# Altium schematic sheet Sheet3.SchDoc
size A3; SheetNumber: 1; SheetTotal: 1
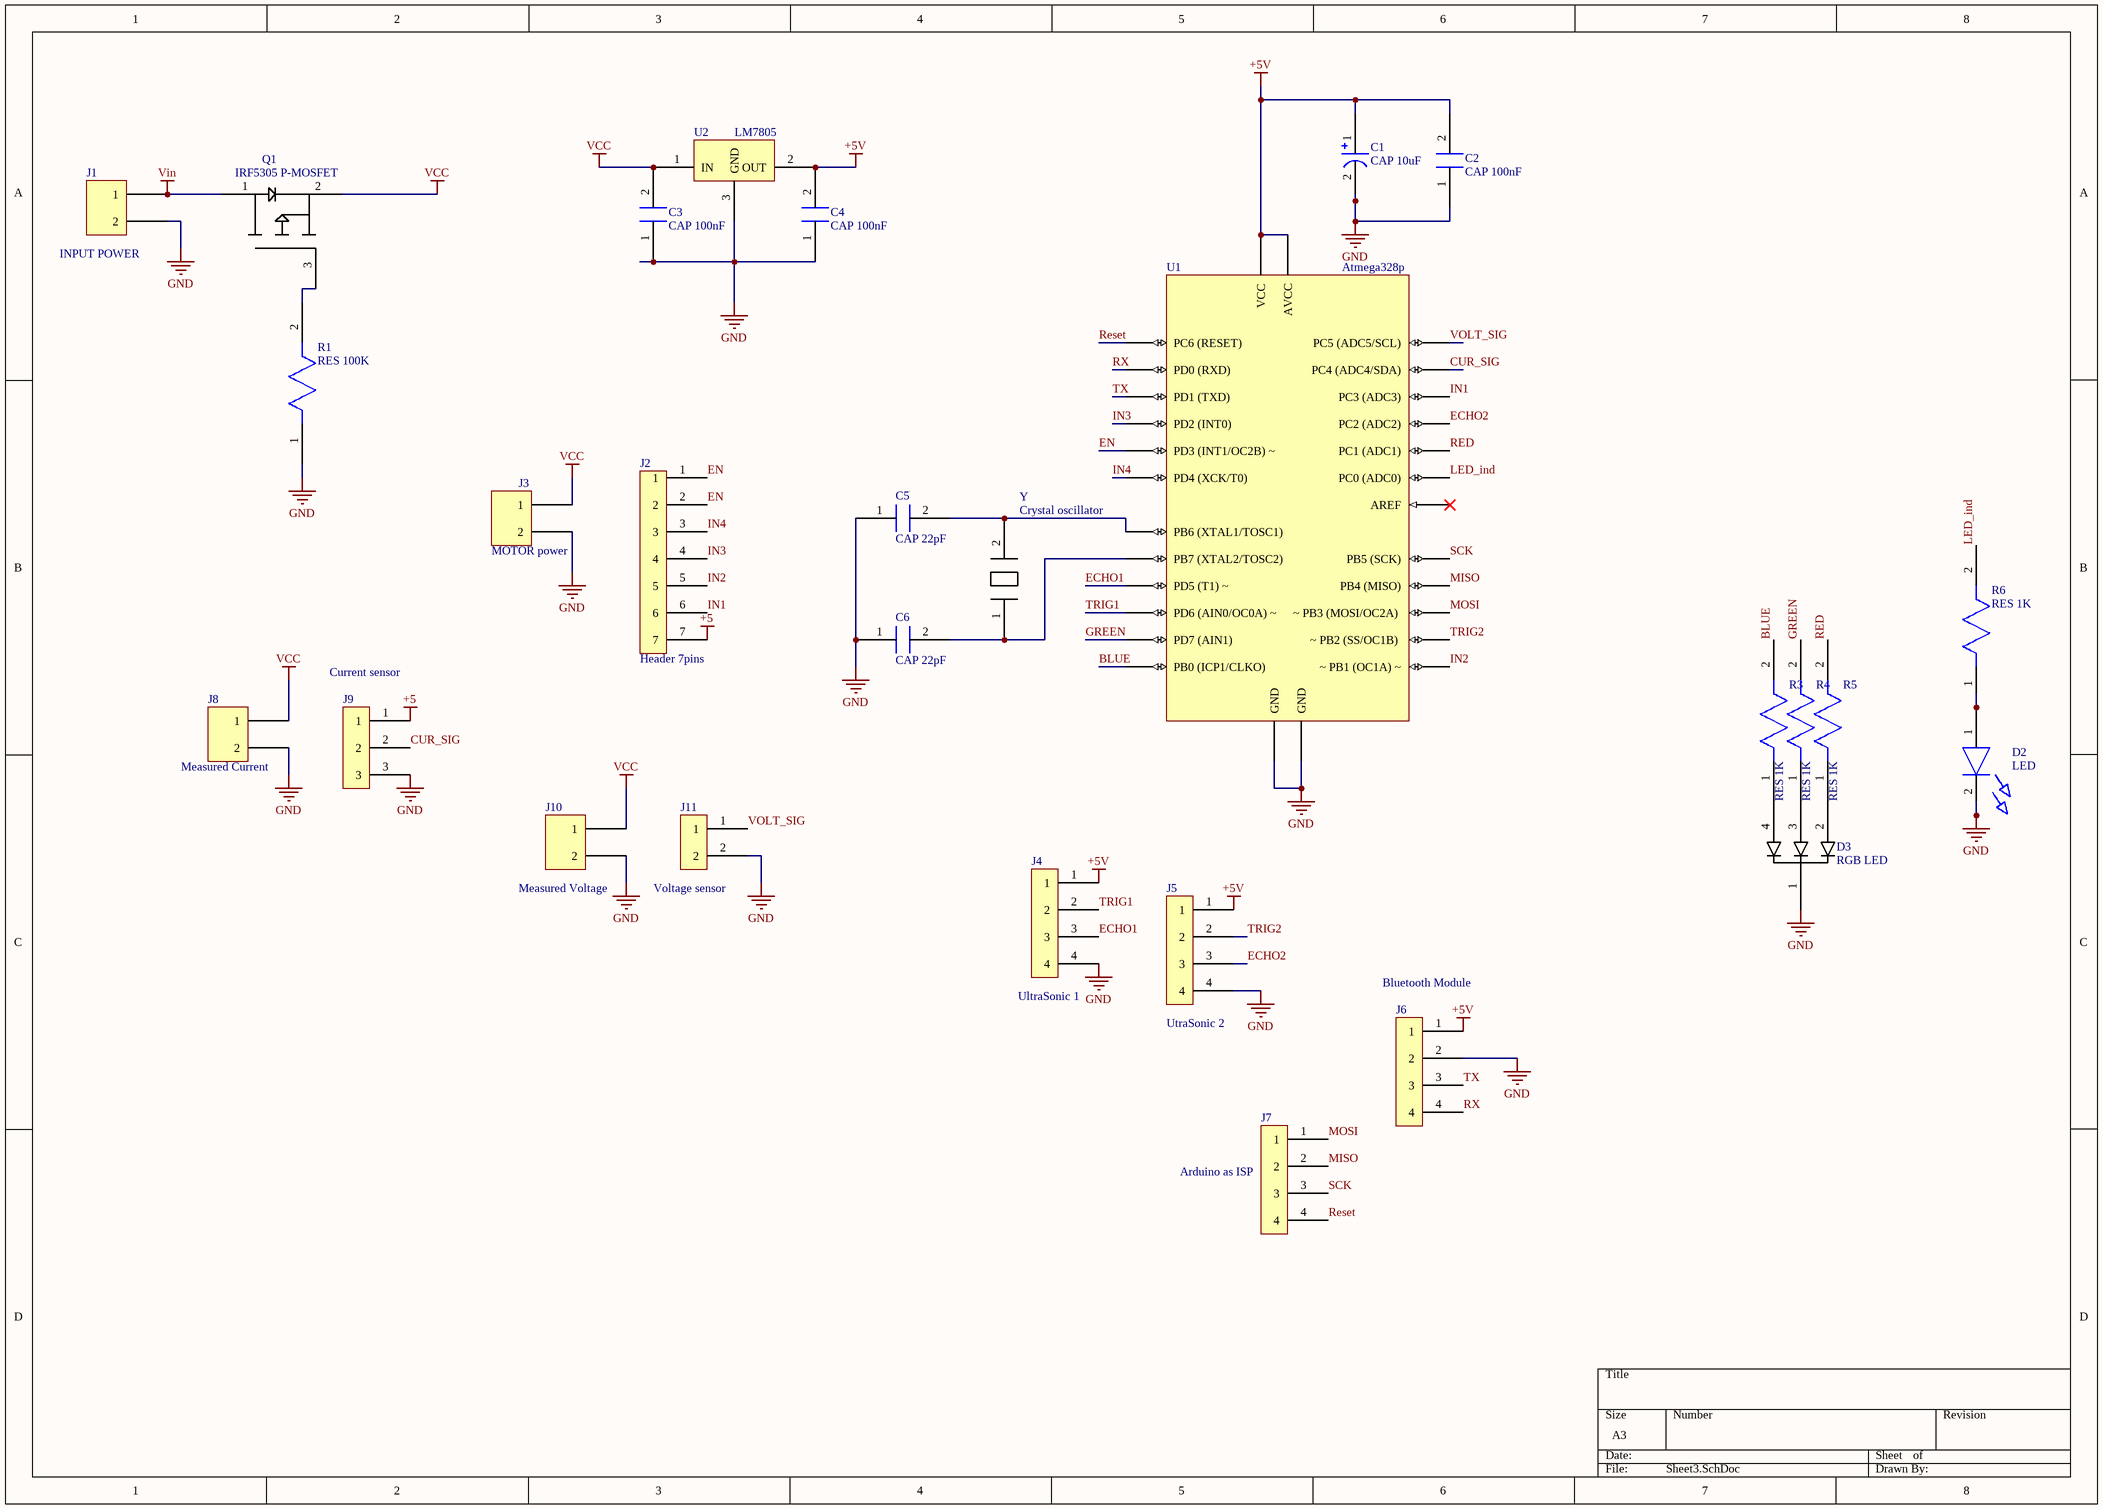
[diagram p0: Sheet3.SchDoc]

## Parts
C1  CAP 10uF  [Cap 10uF]
C2  CAP 100nF  [Cap 100nF]
C3  CAP 100nF  [Cap 100nF]
C4  CAP 100nF  [Cap 100nF]
C5  CAP 22pF  [Cap 22pF]
C6  CAP 22pF  [Cap 22pF]
D2  LED  [LED]
D3  RGB LED  [RGB LED]
J1  INPUT POWER  [Terminal Block 2pin]
J2  Header 7pins  [Header 7pins]
J3  MOTOR power  [Terminal Block 2pin]
J4  UltraSonic 1  [Header 4pin]
J5  UtraSonic 2  [Header 4pin]
J6  Bluetooth Module  [Header 4pin]
J7  Arduino as ISP  [Header 4pin]
J8  Measured Current  [Terminal Block 2pin]
J9  Current sensor  [Headers 3pins]
J10  Measured Voltage  [Terminal Block 2pin]
J11  Voltage sensor  [Header 2pins]
Q1  IRF5305 P-MOSFET  [IRF5305]
R1  RES 100K  [Res100K]
R3  RES 1K  [Res 1K]
R4  RES 1K  [Res 1K]
R5  RES 1K  [Res 1K]
R6  RES 1K  [Res 1K]
U1  Atmega328p  [ATMega 328 P-PU - duplicate]
U2  LM7805  [LM7805]
Y  Crystal oscillator  [Crrystal 16MHZ]

## Nets
+5: J2.7 J9.1
+5V: C1.1 C2.2 C4.2 J4.1 J5.1 J6.1 U1.7(VCC) U1.20(AVCC) U2.2(OUT)
GND: C1.2 C2.1 C3.1 C4.1 C5.1 C6.1 D2.2 D3.1((-)) J1.2 J3.2 J4.4 J5.4 J6.2 J8.2 J9.3 J10.2 J11.2 R1.1 U1.8(GND) U1.22(GND) U2.3(GND)
VCC: C3.2 J3.1 J8.1 J10.1 Q1.2(S) U2.1(IN)
Vin: J1.1 Q1.1(D)
BLUE: R3.2 U1.14(PB0_(ICP1/CLKO))
CUR_SIG: J9.2 U1.27(PC4_(ADC4/SDA))
ECHO1: J4.3 U1.11(PD5_(T1)_~)
ECHO2: J5.3 U1.25(PC2_(ADC2))
EN: J2.1 J2.2 U1.5(PD3_(INT1/OC2B)_~)
GREEN: R4.2 U1.13(PD7_(AIN1))
IN1: J2.6 U1.26(PC3_(ADC3))
IN2: J2.5 U1.15(~_PB1_(OC1A)_~)
IN3: J2.4 U1.4(PD2_(INT0))
IN4: J2.3 U1.6(PD4_(XCK/T0))
LED_ind: R6.2 U1.23(PC0_(ADC0))
MISO: J7.2 U1.18(PB4_(MISO))
MOSI: J7.1 U1.17(~_PB3_(MOSI/OC2A))
RED: R5.2 U1.24(PC1_(ADC1))
Reset: J7.4 U1.1(PC6_(RESET))
RX: J6.4 U1.2(PD0_(RXD))
SCK: J7.3 U1.19(PB5_(SCK))
TRIG1: J4.2 U1.12(PD6_(AIN0/OC0A)_~)
TRIG2: J5.2 U1.16(~_PB2_(SS/OC1B))
TX: J6.3 U1.3(PD1_(TXD))
VOLT_SIG: J11.1 U1.28(PC5_(ADC5/SCL))
NetC5_2: C5.2 U1.9(PB6_(XTAL1/TOSC1)) Y.2
NetC6_2: C6.2 U1.10(PB7_(XTAL2/TOSC2)) Y.1
NetD2_1: D2.1 R6.1
NetD3_2: D3.2(R) R5.1
NetD3_3: D3.3(G) R4.1
NetD3_4: D3.4(B) R3.1
NetQ1_3: Q1.3(G) R1.2

Not connected (* = marked no-connect by the designer): U1 21(AREF)*

## Library data of the parts
C1 = CAP 10uF_1
J1 J3 J8 J10 = TerminalBlock 2pin: Mfr number: *; Parameter 2: *; Parameter 3: *; Parameter 4: *
J4-J7 = Headers 4pin
J9 = Header 3pins
J11 = Headers 2pins